# Altium schematic sheet f407 board.SchDoc
size D
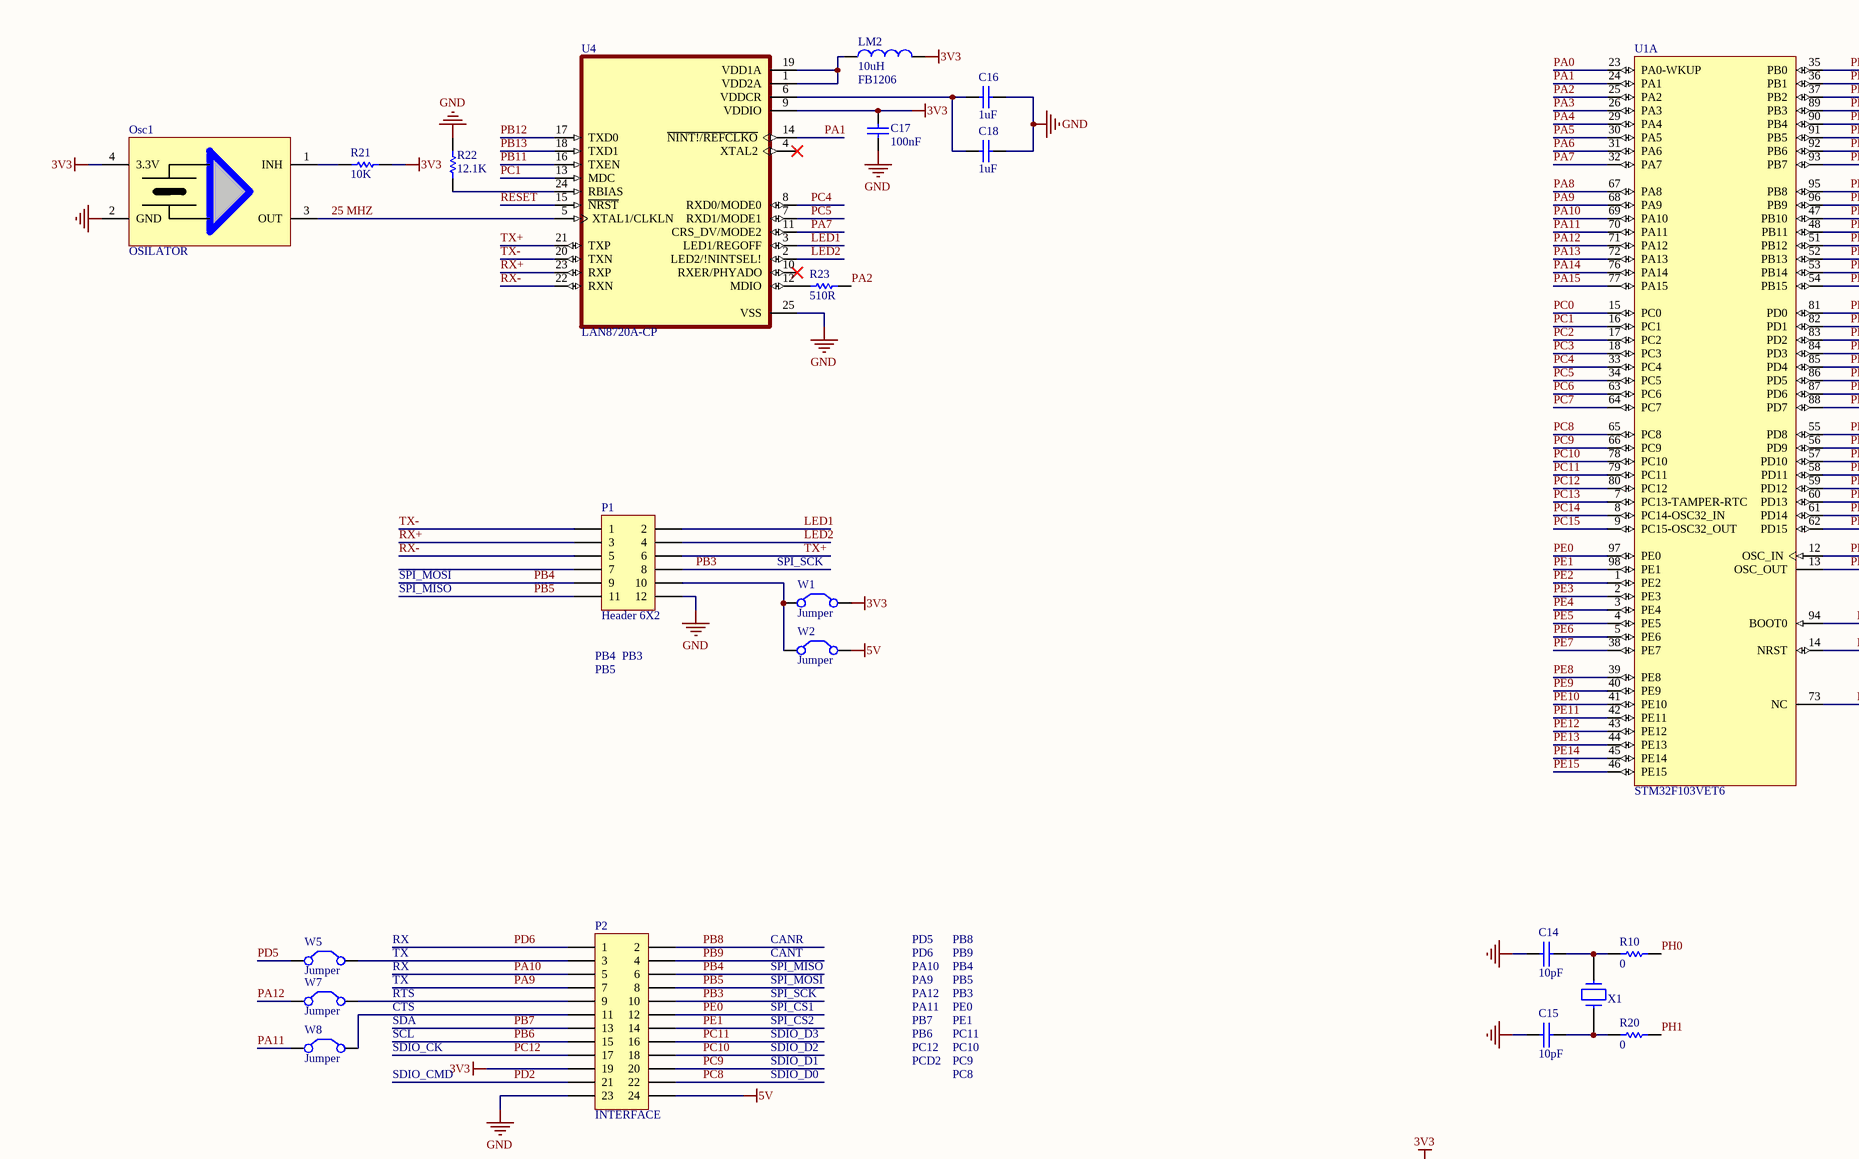
[diagram p0: f407 board.SchDoc, top left]
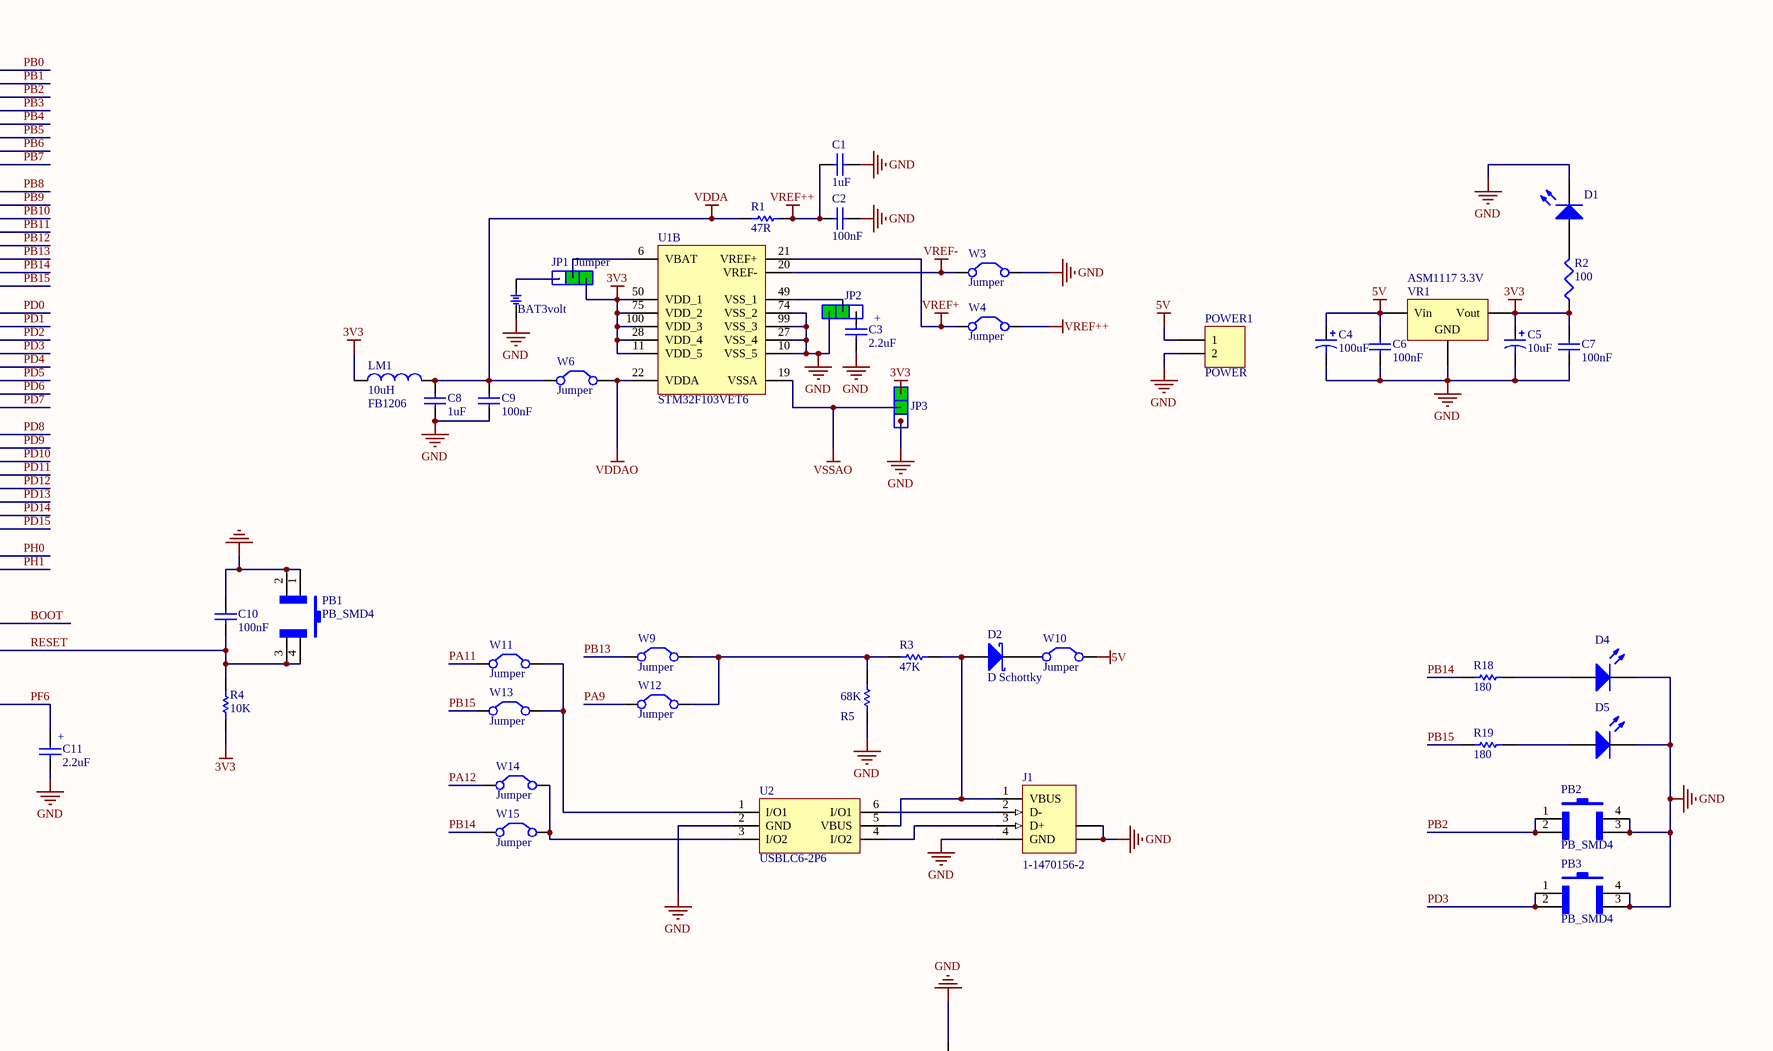
[diagram p1: f407 board.SchDoc, top right]
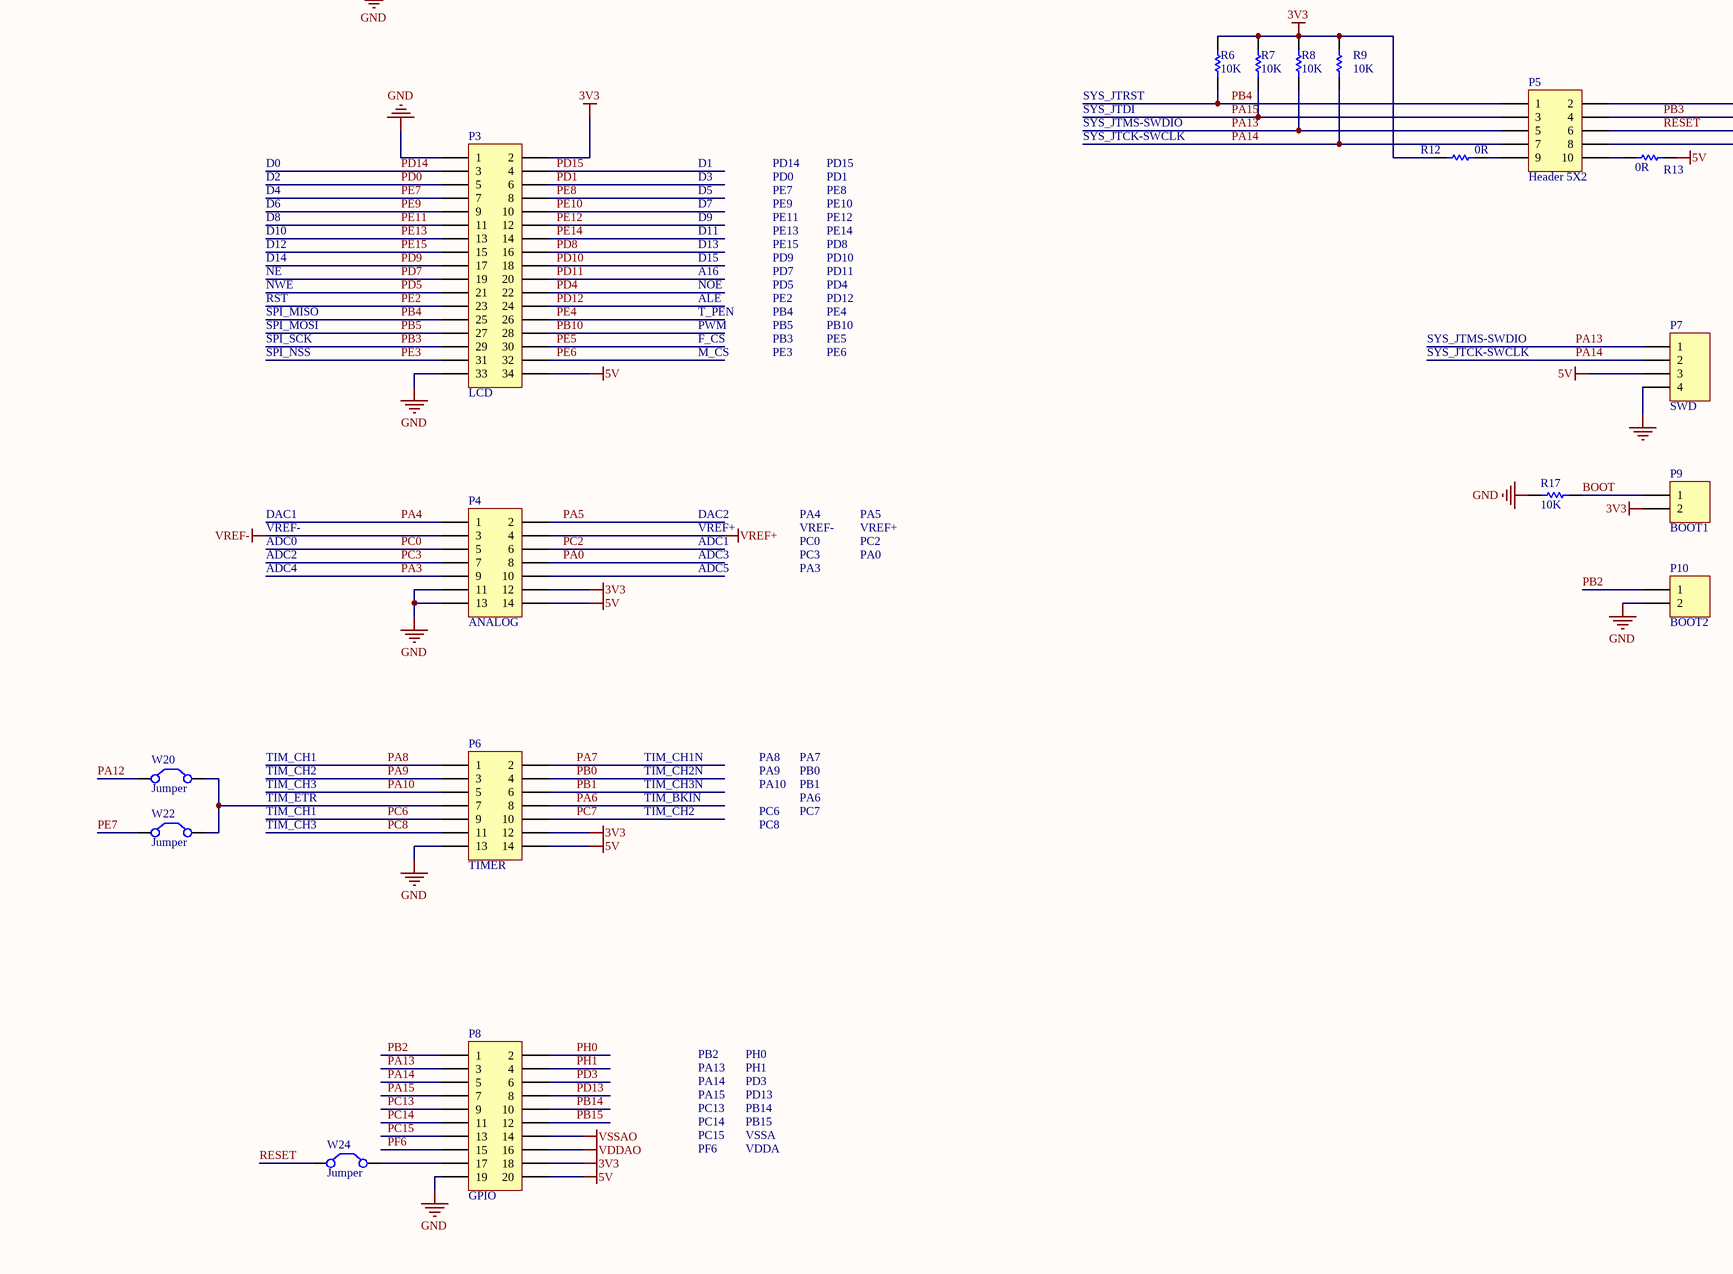
[diagram p2: f407 board.SchDoc, bottom left]
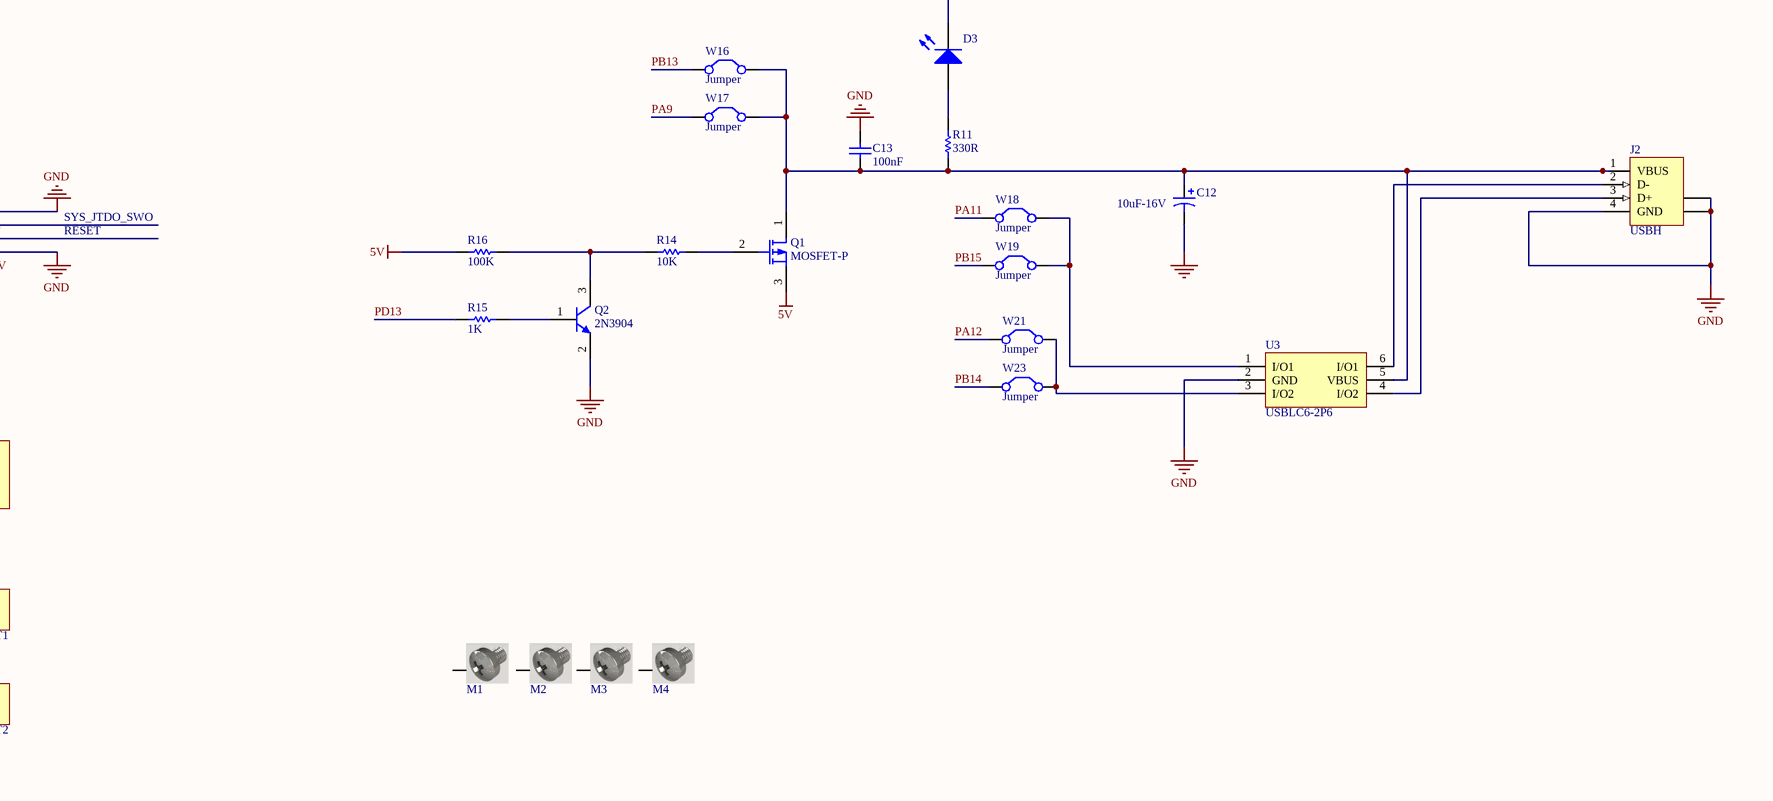
[diagram p3: f407 board.SchDoc, bottom right]

## Parts
BT1  BAT3volt  [BTH1220]
C1  1uF  [0805]
C2  100nF  [0805]
C3  2.2uF  [0805]
C4  100uf  [CAP470]
C5  10uf  [CAP10]
C6  100nF  [0805]
C7  100nF  [0805]
C8  1uF  [0805]
C9  100nF  [0805]
C10  100nF  [0805]
C11  2.2uF  [0805]
C12  10uF-16V  [cap10]
C13  value 100nF  [0805]  (hidden comment: 10uf)
C14  10pF  [0805]
C15  10pF  [0805]
C16  1uF  [0805]
C17  100nF  [0805]
C18  1uF  [0805]
D1  LED0  [LED_0805]  (value not drawn)
D2  D Schottky  [SOD80, LL-34]
D3  LED0  [LED_0805]  (value not drawn)
D4  LED0  [LED_0805]  (value not drawn)
D5  LED0  [LED_0805]  (value not drawn)
J1  1-1470156-2  [440247]
J2  USBH  [787761]
JP1  Jumper  [JT3]
JP2  Jumper  [JT3]  (value not drawn)
JP3  Jumper  [JT3]  (value not drawn)
LM1  10uH  value FB1206  [0805]
LM2  10uH  value FB1206  [0805]
M1  Screw3mm  [Board Screw 3mm]  (value not drawn)
M2  Screw3mm  [Board Screw 3mm]  (value not drawn)
M3  Screw3mm  [Board Screw 3mm]  (value not drawn)
M4  Screw3mm  [Board Screw 3mm]  (value not drawn)
Osc1  OSILATOR  [XTAL_5X7]
P1  Header 6X2  [HDR2X6]
P2  INTERFACE  [HDR2X12]
P3  LCD  [HDR2X17]
P4  ANALOG  [HDR2X7]
P5  Header 5X2  [HDR2X5]
P6  TIMER  [HDR2X7]
P7  SWD  [HDR1X4]
P8  GPIO  [HDR2X10]
P9  BOOT1  [HDR1X2]
P10  BOOT2  [HDR1X2]
PB1  PB_SMD4  [PB_SMD4]
PB2  PB_SMD4  [PB_SMD4]
PB3  PB_SMD4  [PB_SMD4]
POWER1  POWER  [power jack]
Q1  MOSFET-P  [SUPER SOT_3]
Q2  2N3904  [SOT-23]
R1  47R  [0805]
R2  100  [0805]
R3  47K  [0805]
R4  10K  [0805]
R5  68K  [0805]
R6  10K  [0805]
R7  10K  [0805]
R8  10K  [0805]
R9  10K  [0805]
R10  0  [0805]
R11  330R  [0805]
R12  0R  [0805]
R13  0R  [0805]
R14  10K  [0805]
R15  1K  [0805]
R16  100K  [0805]
R17  10K  [0805]
R18  180  [0805]
R19  180  [0805]
R20  0  [0805]
R21  10K  [0805]
R22  12.1K  [0805]
R23  510R  [0805]
U1  STM32F103VET6  [LQFP100]  (parts A,B of 2)
U2  USBLC6-2P6  [SOT23-6]
U3  USBLC6-2P6  [SOT23-6]
U4  LAN8720A-CP  [QFN50P400X400X100-25N]
VR1  ASM1117 3.3V  [Regolator]
W1  Jumper  [JP2_SMD]
W2  Jumper  [JP2_SMD]
W3  Jumper  [JP2_SMD]
W4  Jumper  [JP2_SMD]
W5  Jumper  [JP2_SMD]
W6  Jumper  [JP2_SMD]
W7  Jumper  [JP2_SMD]
W8  Jumper  [JP2_SMD]
W9  Jumper  [JP2_SMD]
W10  Jumper  [JP2_SMD]
W11  Jumper  [JP2_SMD]
W12  Jumper  [JP2_SMD]
W13  Jumper  [JP2_SMD]
W14  Jumper  [JP2_SMD]
W15  Jumper  [JP2_SMD]
W16  Jumper  [JP2_SMD]
W17  Jumper  [JP2_SMD]
W18  Jumper  [JP2_SMD]
W19  Jumper  [JP2_SMD]
W20  Jumper  [JP2_SMD]
W21  Jumper  [JP2_SMD]
W22  Jumper  [JP2_SMD]
W23  Jumper  [JP2_SMD]
W24  Jumper  [JP2_SMD]
X1  HC-49S-C16QSA-8M(jfvny)(with socket)  [XTAL_DIP]  (value not drawn)

## Nets
3V3: C5.1 C7.1 C17.1 JP1.1 JP3.1 LM1.1 LM2.2 Osc1.4(3.3V) P2.19 P3.2 P4.12 P6.12 P8.18 P9.2 R2.1 R4.1 R6.2 R7.2 R8.2 R9.2 R12.2 R21.2 U1.11(VDD_5) U1.28(VDD_4) U1.50(VDD_1) U1.75(VDD_2) U1.100(VDD_3) U4.9(VDDIO) VR1.4(Vout) W1.2(C2)
5V: C4.1 C6.1 P2.24 P3.34 P4.14 P6.14 P7.3 P8.20 POWER1.1 Q1.3(S) R13.2 R16.2 VR1.3(Vin) W2.2(C2) W10.2(C2)
GND: BT1.2 C1.1 C2.1 C3.2 C4.2 C5.2 C6.2 C7.2 C8.1 C9.1 C10.1 C11.2 C12.2 C13.1 C14.2 C15.2 C16.1 C17.2 C18.1 D1.2(K) D3.2(K) D4.2(K) D5.2(K) J1.4(GND) J1.5(GND) J1.6(GND) J2.4(GND) J2.5(SHLD) J2.6(SHLD) JP2.1 JP3.3 Osc1.2(GND) P1.12 P2.23 P3.1 P3.33 P4.11 P4.13 P5.2 P5.8 P6.13 P7.4 P8.19 P10.2 PB1.1 PB1.2 PB2.3 PB2.4 PB3.3 PB3.4 POWER1.2 Q2.2(E) R5.2 R17.2 R22.2 U1.10(VSS_5) U1.27(VSS_4) U1.74(VSS_2) U1.99(VSS_3) U2.2(GND) U3.2(GND) U4.25(VSS) VR1.1(GND) W3.2(C2)
VDDA: C8.2 C9.2 LM1.2 R1.2 W6.1(C1)
VDDAO: P8.16 U1.22(VDDA) W6.2(C2)
VREF+: P4.4 U1.21(VREF+) W4.1(C1)
VREF++: C1.2 C2.2 R1.1 W4.2(C2)
VREF-: P4.3 U1.20(VREF-) W3.1(C1)
VSSAO: JP3.2 P8.14 U1.19(VSSA)
25 MHZ: Osc1.3(OUT) U4.5(XTAL1/CLKLN)
BOOT: P9.1 R17.1 U1.94(BOOT0)
LED1: P1.2 U4.3(LED1/REGOFF)
LED2: P1.4 U4.2(LED2/!NINTSEL!)
PA0: P4.8 U1.23(PA0-WKUP)
PA1: U1.24(PA1) U4.14(~{NINT!/REFCLKO})
PA2: R23.2 U1.25(PA2)
PA3: P4.9 U1.26(PA3)
PA4: P4.1 U1.29(PA4)
PA5: P4.2 U1.30(PA5)
PA6: P6.8 U1.31(PA6)
PA7: P6.2 U1.32(PA7) U4.11(CRS_DV/MODE2)
PA8: P6.1 U1.67(PA8)
PA9: P2.7 P6.3 U1.68(PA9) W12.1(C1) W17.1(C1)
PA10: P2.5 P6.5 U1.69(PA10)
PA11: U1.70(PA11) W8.1(C1) W11.1(C1) W18.1(C1)
PA12: U1.71(PA12) W7.1(C1) W14.1(C1) W20.1(C1) W21.1(C1)
PA13: P5.5 P7.1 P8.3 R8.1 U1.72(PA13)
PA14: P5.7 P7.2 P8.5 R9.1 U1.76(PA14)
PA15: P5.3 P8.7 R7.1 U1.77(PA15)
PB0: P6.4 U1.35(PB0)
PB1: P6.6 U1.36(PB1)
PB2: P8.1 P10.1 PB2.1 PB2.2 U1.37(PB2)
PB3: P1.8 P2.10 P3.29 P5.4 U1.89(PB3)
PB4: P1.9 P2.6 P3.25 P5.1 R6.1 U1.90(PB4)
PB5: P1.11 P2.8 P3.27 U1.91(PB5)
PB6: P2.15 U1.92(PB6)
PB7: P2.13 U1.93(PB7)
PB8: P2.2 U1.95(PB8)
PB9: P2.4 U1.96(PB9)
PB10: P3.28 U1.47(PB10)
PB11: U1.48(PB11) U4.16(TXEN)
PB12: U1.51(PB12) U4.17(TXD0)
PB13: U1.52(PB13) U4.18(TXD1) W9.1(C1) W16.1(C1)
PB14: P8.10 R18.2 U1.53(PB14) W15.1(C1) W23.1(C1)
PB15: P8.12 R19.2 U1.54(PB15) W13.1(C1) W19.1(C1)
PC0: P4.5 U1.15(PC0)
PC1: U1.16(PC1) U4.13(MDC)
PC2: P4.6 U1.17(PC2)
PC3: P4.7 U1.18(PC3)
PC4: U1.33(PC4) U4.8(RXD0/MODE0)
PC5: U1.34(PC5) U4.7(RXD1/MODE1)
PC6: P6.9 U1.63(PC6)
PC7: P6.10 U1.64(PC7)
PC8: P2.22 P6.11 U1.65(PC8)
PC9: P2.20 U1.66(PC9)
PC10: P2.18 U1.78(PC10)
PC11: P2.16 U1.79(PC11)
PC12: P2.17 U1.80(PC12)
PC13: P8.9 U1.7(PC13-TAMPER-RTC)
PC14: P8.11 U1.8(PC14-OSC32_IN)
PC15: P8.13 U1.9(PC15-OSC32_OUT)
PD0: P3.5 U1.81(PD0)
PD1: P3.6 U1.82(PD1)
PD2: P2.21 U1.83(PD2)
PD3: P8.6 PB3.1 PB3.2 U1.84(PD3)
PD4: P3.22 U1.85(PD4)
PD5: P3.21 U1.86(PD5) W5.1(C1)
PD6: P2.1 U1.87(PD6)
PD7: P3.19 U1.88(PD7)
PD8: P3.16 U1.55(PD8)
PD9: P3.17 U1.56(PD9)
PD10: P3.18 U1.57(PD10)
PD11: P3.20 U1.58(PD11)
PD12: P3.24 U1.59(PD12)
PD13: P8.8 R15.1 U1.60(PD13)
PD14: P3.3 U1.61(PD14)
PD15: P3.4 U1.62(PD15)
PE0: P2.12 U1.97(PE0)
PE1: P2.14 U1.98(PE1)
PE2: P3.23 U1.1(PE2)
PE3: P3.31 U1.2(PE3)
PE4: P3.26 U1.3(PE4)
PE5: P3.30 U1.4(PE5)
PE6: P3.32 U1.5(PE6)
PE7: P3.7 U1.38(PE7) W22.1(C1)
PE8: P3.8 U1.39(PE8)
PE9: P3.9 U1.40(PE9)
PE10: P3.10 U1.41(PE10)
PE11: P3.11 U1.42(PE11)
PE12: P3.12 U1.43(PE12)
PE13: P3.13 U1.44(PE13)
PE14: P3.14 U1.45(PE14)
PE15: P3.15 U1.46(PE15)
PF6: C11.1 P8.15 U1.73(NC)
PH0: P8.2 R10.2 U1.12(OSC_IN)
PH1: P8.4 R20.2 U1.13(OSC_OUT)
RESET: C10.2 P5.6 PB1.3 PB1.4 R4.2 U1.14(NRST) U4.15(~{NRST}) W24.1(C1)
RX+: P1.3 U4.23(RXP)
RX-: P1.5 U4.22(RXN)
TX+: P1.6 U4.21(TXP)
TX-: P1.1 U4.20(TXN)
NetBT1_1: BT1.1 JP1.3
NetC3_1: C3.1 JP2.3
NetC12_1: C12.1 C13.2 J2.1(VBUS) Q1.1(D) R11.2 U3.5(VBUS) W16.2(C2) W17.2(C2)
NetC14_1: C14.1 R10.1 X1.1
NetC15_1: C15.1 R20.1 X1.2
NetC16_2: C16.2 C18.2 U4.6(VDDCR)
NetD1_1: D1.1(A) R2.2
NetD2_A: D2.A J1.1(VBUS) R3.2 U2.5(VBUS)
NetD2_K: D2.K W10.1(C1)
NetD3_1: D3.1(A) R11.1
NetD4_1: D4.1(A) R18.1
NetD5_1: D5.1(A) R19.1
NetJ1_2: J1.2(D-) U2.6(I/O1)
NetJ1_3: J1.3(D+) U2.4(I/O2)
NetJ2_2: J2.2(D-) U3.6(I/O1)
NetJ2_3: J2.3(D+) U3.4(I/O2)
NetJP1_2: JP1.2 U1.6(VBAT)
NetJP2_2: JP2.2 U1.49(VSS_1)
NetLM2_1: LM2.1 U4.1(VDD2A) U4.19(VDD1A)
NetOsc1_1: Osc1.1(INH) R21.1
NetP1_10: P1.10 W1.1(C1) W2.1(C1)
NetP2_3: P2.3 W5.2(C2)
NetP2_9: P2.9 W7.2(C2)
NetP2_11: P2.11 W8.2(C2)
NetP5_9: P5.9 R12.1
NetP5_10: P5.10 R13.1
NetP6_7: P6.7 W20.2(C2) W22.2(C2)
NetP8_17: P8.17 W24.2(C2)
NetQ1_2: Q1.2(G) R14.1
NetQ2_1: Q2.1(B) R15.2
NetQ2_3: Q2.3(C) R14.2 R16.1
NetR3_1: R3.1 R5.1 W9.2(C2) W12.2(C2)
NetR22_1: R22.1 U4.24(RBIAS)
NetR23_1: R23.1 U4.12(MDIO)
NetU2_1: U2.1(I/O1) W11.2(C2) W13.2(C2)
NetU2_3: U2.3(I/O2) W14.2(C2) W15.2(C2)
NetU3_1: U3.1(I/O1) W18.2(C2) W19.2(C2)
NetU3_3: U3.3(I/O2) W21.2(C2) W23.2(C2)

Not connected (* = marked no-connect by the designer): M1 S; M2 S; M3 S; M4 S; P1 7; P4 10; U4 4(XTAL2)* 10(RXER/PHYADO)*

## Notes on the sheet
- +
- SPI_MOSI
- (near W1) SPI_SCK
- SPI_MISO
- PB4
- PB5
- PB3
- (near C11) +
- TX
- RX
- CANR
- CANT
- PD5
- PD6
- PA9
- PA10
- PB8
- PB9
- CTS
- RTS
- SDA
- SCL
- SDIO_CK
- SPI_SCK
- SPI_CS1
- SPI_CS2
- SDIO_D2
- SDIO_D3
- PC12
- PB6
- PB7
- PA11
- PA12
- PE0
- PE1
- PC10
- PC11
- (near W8) SDIO_CMD
- SDIO_D0
- SDIO_D1
- PCD2
- PC8
- PC9
- SYS_JTRST
- SYS_JTDI
- SYS_JTMS-SWDIO
- SYS_JTDO_SWO
- RESET
- D0
- D2
- D4
- D1
- D3
- D5
- PD14
- PD0
- PE7
- PD15
- PD1
- PE8
- SYS_JTCK-SWCLK
- D6
- D8
- D10
- D12
- D14
- D7
- D9
- D11
- D13
- D15
- PE9
- PE11
- PE13
- PE15
- PD9
- PE10
- PE12
- PE14
- PD8
- PD10
- NE
- NWE
- RST
- PWM
- T_PEN
- NOE
- A16
- ALE
- PD7
- PE2
- PD11
- PD12
- PD4
- PE4
- PB10
- SPI_NSS
- M_CS
- F_CS
- PE3
- PE5
- PE6
- DAC1
- VREF-
- DAC2
- VREF+
- PA4
- PA5
- ADC0
- ADC2
- ADC4
- ADC1
- ADC3
- ADC5
- PA3
- PC0
- PC3
- PA0
- PC2
- TIM_CH1
- TIM_CH2
- TIM_CH3
- TIM_ETR
- TIM_CH1N
- TIM_CH2N
- TIM_CH3N
- TIM_BKIN
- PA8
- PB0
- PB1
- PA6
- PA7
- PC6
- PC7
- PA13
- PB2
- PH0
- PH1
- PA14
- PA15
- PC13
- PC14
- PC15
- PD3
- PD13
- PB14
- PB15
- VSSA
- PF6
- VDDA

## Library data of the parts
BT1 = BATH_CR1220_CR2032: BATTERY HOLDER, CR1220/CR2032; VALUE: BAT3volt; MANF_P#: -; .: http://www.chila.ir
C1-C3 C8 C9 C11 C16-C18 = CAP SMD 1206: CAP 1206; Designer: Abbas Basereh; Desc.: CAP SMD 1206; Data: 16-12-2016
C4 C5 = Cap Pol1: Polarized Capacitor (Radial); Published: 8-Jun-2000; LatestRevisionDate: 17-Jul-2002; LatestRevisionNote: Re-released for DXP Platform.; PackageReference: RB7.6-15; Publisher: Altium Limited
  C4: Value: 100uF
  C5: Value: 10uF
C6 C7 C13 = Cap Semi: Capacitor (Semiconductor SIM Model); Published: 8-Jun-2000; LatestRevisionDate: 29-May-2009; LatestRevisionNote: IPC-7351 Footprint Added.; PackageReference: 0603C; Publisher: Altium Limited; PackageDescription: Chip Capacitor
  C6 C7: Value: 100nF
C10 = CAP: Capacitor; Value: 100pF; Published: 8-Jun-2000; Revision: July-2002: Re-released for DXP Platform.; Publisher: Altium Limited
C12 = 3-CAP-POL: Polarized Capacitor; Type: Electrolit (Radial)
C14 C15 = CAP: Capacitor
D1 D3-D5 = LED0: Typical INFRARED GaAs LED; Published: 8-Jun-2000; LatestRevisionDate: 08-Jul-2005; LatestRevisionNote: Mech Layer 1 removed.; PackageReference: LED-0; Publisher: Altium Limited
D2 = D Schottky: Schottky Diode; Published: 8-Jun-2000; LatestRevisionDate: 17-Jul-2002; LatestRevisionNote: Re-released for DXP Platform.; PackageReference: SMB; Publisher: Altium Limited; Code_JEDEC: DO-214-AA
J1 = 1-1470156-2: USB 1.1, Right Angle, Thru-Hole, B Type, Receptacle, 4 Position, Black; ContactMaterial: Phosphor Bronze; ContactPlating: Gold over Nickel; TerminationLength: 3.00mm [0.118in.]; PCB_Layout: Complies with manufacturer's recommendation.; DrillSize: Corresponds to nominal value.; PanelGround: Without; Published: 15-Jul-2004; DatasheetDocument: 02-Jun-2001; PackageDocument: 02-Jun-2001; PackageReference: 1-1470156; Publisher: Altium Limited; HousingMaterial: Glass-Filled Thermoplastic; ComponentLink1Description: Manufacturer Link; ComponentLink1URL: http://www.tycoelectronics.com/; ComponentLink2Description: Packaging Specification; ComponentLink2URL: http://ecommas.tycoelectronics.com/commerce/DocumentDelivery/DDEController?Action=showdoc&DocId=Customer+Drawing%7F1470156%7FO%7Ftif%7FEnglish%7FC_1470156_O.tif
J2 = 787761-3: USB 1.1, Right Angle, Thru-Hole, A Type, Receptacle, 4 Position, Natural; ContactMaterial: Copper Alloy; ContactPlating: Gold Flash over Palladium Nickel or Gold (30) over Nickel; TerminationLength: 2.84mm [0.112in.]; PCB_Layout: Complies with manufacturer's recommendation.; DrillSize: Corresponds to nominal value.; PanelGround: Without; Published: 15-Jul-2004; DatasheetDocument: 11-Jan-2004; PackageDocument: 11-Jan-2004; PackageReference: 787761; Publisher: Altium Limited; HousingMaterial: Thermoplastic; ComponentLink1Description: Manufacturer Link; ComponentLink1URL: http://www.tycoelectronics.com/; ComponentLink2Description: Packaging Specification; ComponentLink2URL: http://ecommas.tycoelectronics.com/commerce/DocumentDelivery/DDEController?Action=showdoc&DocId=Customer+Drawing%7F787761%7FH%7Ftif%7FEnglish%7FENG_CD_787761_H.tif
JP1-JP3 = Jumper Selector
LM1 LM2 = L SMA 0.25W: Inductor; Code_IEC: 1005; Published: 8-Jun-2000; LatestRevisionDate: 29-May-2009; LatestRevisionNote: IPC-7351 Footprint Added.; PackageReference: 0402-A; Publisher: Altium Limited; PackageDescription: Chip Inductor; Code_JEITA: 0402
M1-M4 = Board Screw 3mm: Board Screw With Spacer 3mm; Designer: Abbas Basereh; Data: 16-12-2016; Link: *; Part. No: *
P1 = Header 6X2: Header, 6-Pin, Dual row; LatestRevisionDate: 17-Jul-2002; LatestRevisionNote: Re-released for DXP Platform.; Publisher: Altium Limited
P2 = Header 12X2: Header, 12-Pin, Dual row; LatestRevisionDate: 17-Jul-2002; LatestRevisionNote: Re-released for DXP Platform.; Publisher: Altium Limited
P3 = Header 17X2: Header, 17-Pin, Dual row; LatestRevisionDate: 17-Jul-2002; LatestRevisionNote: Re-released for DXP Platform.; Publisher: Altium Limited
P4 P6 = Header 7X2: Header, 7-Pin, Dual row; LatestRevisionDate: 17-Jul-2002; LatestRevisionNote: Re-released for DXP Platform.; Publisher: Altium Limited
P5 = Header 5X2: Header, 5-Pin, Dual row; LatestRevisionDate: 17-Jul-2002; LatestRevisionNote: Re-released for DXP Platform.; Publisher: Altium Limited
P7 = Header 4: Header, 4-Pin; LatestRevisionDate: 17-Jul-2002; LatestRevisionNote: Re-released for DXP Platform.; Publisher: Altium Limited
P8 = Header 10X2: Header, 10-Pin, Dual row; LatestRevisionDate: 17-Jul-2002; LatestRevisionNote: Re-released for DXP Platform.; Publisher: Altium Limited
P9 P10 = Header 2: Header, 2-Pin; LatestRevisionDate: 17-Jul-2002; LatestRevisionNote: Re-released for DXP Platform.; Publisher: Altium Limited
PB1-PB3 = PB_SMD4: Part_Number: SW-PB-AX-SMD4; Anbar_Code: 101141991; Revision: July-2002: Re-released for DXP Platform.
POWER1 = Header 2H: Header, 2-Pin, Right Angle; LatestRevisionDate: 17-Jul-2002; LatestRevisionNote: Re-released for DXP Platform.; Publisher: Altium Limited
Q1 = MOSFET-P: P-Channel MOSFET; Published: 8-Jun-2000; LatestRevisionDate: 17-Jul-2002; LatestRevisionNote: Re-released for DXP Platform.; PackageVersion: 1995/1996; PackageReference: E3; Publisher: Altium Limited; PackageDescription: TO, Flat Index; 3 In-Line, Axial Leads; Body Dia. 4.6mm; Lead Dia. 0.5 mm (max)
Q2 = 2N3904: NPN General Purpose Amplifier; Published: 8-Jun-2000; LatestRevisionDate: 15-Jan-2003; LatestRevisionNote: PCB Footprint 'BCY-W3/D4.7' replaced; DatasheetVersion: 1997; PackageVersion: Sep-1998; PackageReference: TO-92A; Publisher: Altium Limited; PackageDescription: TO, Flat Index; 3 In-Line, Axial Leads; Body Dia. 4.5mm; Leads 0.51 x 0.48 mm (max); ComponentLink1Description: Manufacturer Link; ComponentLink1URL: http://www.fairchildsemi.com/; ComponentLink2Description: Datasheet; ComponentLink2URL: http://www.fairchildsemi.com/ds/2N%2F2N3904.pdf
R1 = RES 1206 0.25W: RES 1206; Designer: Abbas Basereh; Desc.: RES SMD 1206; Data: 16-12-2016
R2 = Res3: Resistor; Published: 8-Jun-2000; LatestRevisionDate: 29-May-2009; LatestRevisionNote: IPC-7351 Footprint Added.; PackageReference: J1-0603; Publisher: Altium Limited; PackageDescription: Chip Resistor; Value: 100
R3 R5 R11 R15 R16 R22 R23 = Res1: Resistor; Value: 10K; Published: 8-Jun-2000; LatestRevisionDate: 17-Jul-2002; LatestRevisionNote: Re-released for DXP Platform.; PackageReference: AXIAL-0.3; Publisher: Altium Limited; PackageDescription: Axial Device, Thru-Hole; 2 Leads; 0.3 in Pin Spacing
R4 = res1: Resistor; Value: 1K; Published: 8-Jun-2000; Revision: July-2002: Re-released for DXP Platform.; Publisher: Altium Limited
R6-R10 R12 R13 R17-R20 = Res1: Resistor; Value: 1K; Published: 8-Jun-2000; Revision: July-2002: Re-released for DXP Platform.; Publisher: Altium Limited
R14 R21 = Res1: Resistor; Published: 8-Jun-2000; LatestRevisionDate: 17-Jul-2002; LatestRevisionNote: Re-released for DXP Platform.; PackageReference: AXIAL-0.3; Publisher: Altium Limited; PackageDescription: Axial Device, Thru-Hole; 2 Leads; 0.3 in Pin Spacing; Value: 10K
U1 = STM32F103VET6: ARM Cortex-M3 32-bit MCU, 512 KB Flash, 64 KB Internal RAM, 80 I/Os, 100-pin LQFP, -40 to 85 degC, Tray; A/D Converter: 3x12-bit (16 Channel); D/A Converter: 2x12-bit (2 Channel); FLASH Size (Prog) (kB): 512; I/Os (High Current): 80; Internal RAM Size (kB): 64; Operating Frequency(F) (Processor speed) (MHz): 72; Supply Voltage(Vcc) min (V): 2; DatasheetVersion: Rev. 8; PackageVersion: Rev. 1, 06/2013; PackageReference: LQFP100; PackageDescription: 100-Pin Low Profile Quad Flat Package, 14 x 14 mm Body, 0.5 mm Pitch; Supplier 1: Digi-Key; Supplier Part Number 1: 497-6443-ND; Supplier 2: Farnell; Supplier Part Number 2: 1624141; Supplier 3: Newark; Supplier Part Number 3: 01P4104; Supplier 4: Newark; Supplier Part Number 4: 57P1260; Supplier 5: Mouser; Supplier Part Number 5: 511-STM32F103VET6; Core: ARM Cortex-M3; Packing: Tray; Mounting Technology: Surface Mount; PartNumber: STM32F103VET6; ComponentLink1Description: Manufacturer URL; ComponentLink1URL: http://www.st.com/web/en/home.html; ComponentLink2Description: Datasheet; ComponentLink2URL: http://www.st.com/st-web-ui/static/active/en/resource/technical/document/datasheet/CD00191185.pdf; ComponentLink3Description: Package Specification; ComponentLink3URL: http://www.st.com/st-web-ui/static/active/en/resource/technical/document/data_brief/DM00071938.pdf
U4 = LAN8720A-CP: 2/2 Transceiver Full RMII 24-QFN-EP _4x4_; MF: Microchip; Package: QFN-24 Microchip; Value: *; Price: None; MP: LAN8720A-CP; SnapEDA_Link: https://www.snapeda.com/parts/LAN8720A-CP/Microchip/view-part/237160/?ref=snap; Availability: Unavailable
VR1 = Volt Reg_1: Voltage Regulator; Published: 24-Mar-1999; LatestRevisionDate: 29-May-2009; LatestRevisionNote: IPC-7351 Footprint Added.; PackageReference: D2PAK; Publisher: Altium Limited; PackageDescription: 3-Pin Transistor Outline Package 2.54 mm Pitch, 15.1 mm Lead Span
W1-W24 = Jumper: Jumper Wire; Published: 24-Mar-1999; LatestRevisionDate: 17-Jul-2002; LatestRevisionNote: Re-released for DXP Platform.; PackageReference: RAD-0.2; Publisher: Altium Limited
X1 = CRYSTAL
U2 U3 = USBLC6-2P6: LINK: http://javanelec.com/productsDetails.aspx?id=7153